# EAGLE schematic PCB schematic (EAGLE 9.5.1)
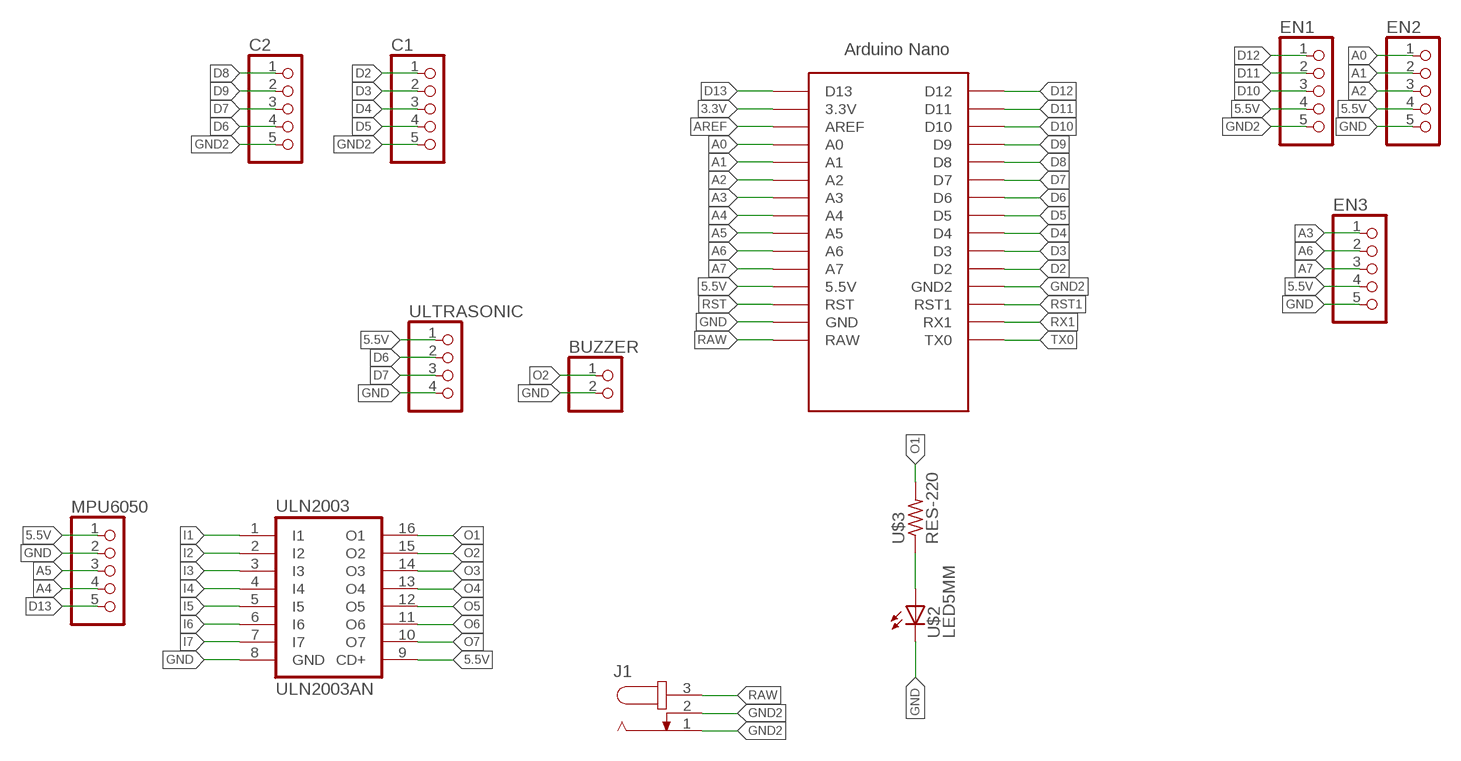
[diagram p0: schematic, sheet 1]

## Parts
BUZZER  PINHD-1X2  [1X02]
C1  PINHD-1X5  [1X05]
C2  PINHD-1X5  [1X05]
EN1  PINHD-1X5  [1X05]
EN2  PINHD-1X5  [1X05]
EN3  PINHD-1X5  [1X05]
J1  JACK-PLUG0  [SPC4077]
MPU6050  PINHD-1X5  [1X05]
U$1  ARDUINO_NANO  [NANO]
U$2  LED5MM  [LED5MM]
U$3  RES-220  RES-5  [0204/5]
ULN2003  ULN2003AN  [DIL16]
ULTRASONIC  PINHD-1X4  [1X04]

## Nets
3.3V: U$1.3.3V
5.5V: EN1.4 EN2.4 EN3.4 MPU6050.1 U$1.5V(5.5V) ULN2003.9(CD+) ULTRASONIC.1
A0: EN2.1 U$1.A0
A1: EN2.2 U$1.A1
A2: EN2.3 U$1.A2
A3: EN3.1 U$1.A3
A4: MPU6050.4 U$1.A4
A5: MPU6050.3 U$1.A5
A6: EN3.2 U$1.A6
A7: EN3.3 U$1.A7
AREF: U$1.AREF
D2: C1.1 U$1.D2
D3: C1.2 U$1.D3
D4: C1.3 U$1.D4
D5: C1.4 U$1.D5
D6: C2.4 U$1.D6 ULTRASONIC.2
D7: C2.3 U$1.D7 ULTRASONIC.3
D8: C2.1 U$1.D8
D9: C2.2 U$1.D9
D10: EN1.3 U$1.D10
D11: EN1.2 U$1.D11
D12: EN1.1 U$1.D12
D13: MPU6050.5 U$1.D13
GND: BUZZER.2 EN2.5 EN3.5 MPU6050.2 U$1.GND U$2.K(C) ULN2003.8(GND) ULTRASONIC.4
GND2: C1.5 C2.5 EN1.5 J1.1 J1.2 U$1.GND1(GND2)
I1: ULN2003.1(I1)
I2: ULN2003.2(I2)
I3: ULN2003.3(I3)
I4: ULN2003.4(I4)
I5: ULN2003.5(I5)
I6: ULN2003.6(I6)
I7: ULN2003.7(I7)
N$1: U$2.A U$3.1
O1: U$3.2 ULN2003.16(O1)
O2: BUZZER.1 ULN2003.15(O2)
O3: ULN2003.14(O3)
O4: ULN2003.13(O4)
O5: ULN2003.12(O5)
O6: ULN2003.11(O6)
O7: ULN2003.10(O7)
RAW: J1.3 U$1.RAW
RST: U$1.RST
RST1: U$1.RST1
RX1: U$1.RX1
TX0: U$1.TX0

## Library data of the parts
BUZZER = MIA-Training:PINHD-1X2: PIN HEADER
C1 C2 EN1-EN3 MPU6050 = MIA-Training:PINHD-1X5: PIN HEADER
J1 = con-jack:JACK-PLUG: DC POWER JACK Power Jack, DC, Right Angle, Through Hole, Rated 5A at 16VDC, PC Terminals Distributor: Farnell (www.Farnell.de) Drawing: 84N1161.pdf / 84N1162.pdf Manufacturer: SPC Technology (www.spctechnology.com) Type: SPC4077 / SPC 4078; OC_FARNELL: unknown; OC_NEWARK: unknown
U$1 = MIA-Training:ARDUINO_NANO: Arduino Nano
U$2 = MIA-Training:LED5MM
U$3 = MIA-Training:RES-5
ULN2003 = MIA-Training:ULN2003A: DRIVER ARRAY
ULTRASONIC = MIA-Training:PINHD-1X4: PIN HEADER